# Altium schematic sheet Barun Gas Control.SchDoc
size A3
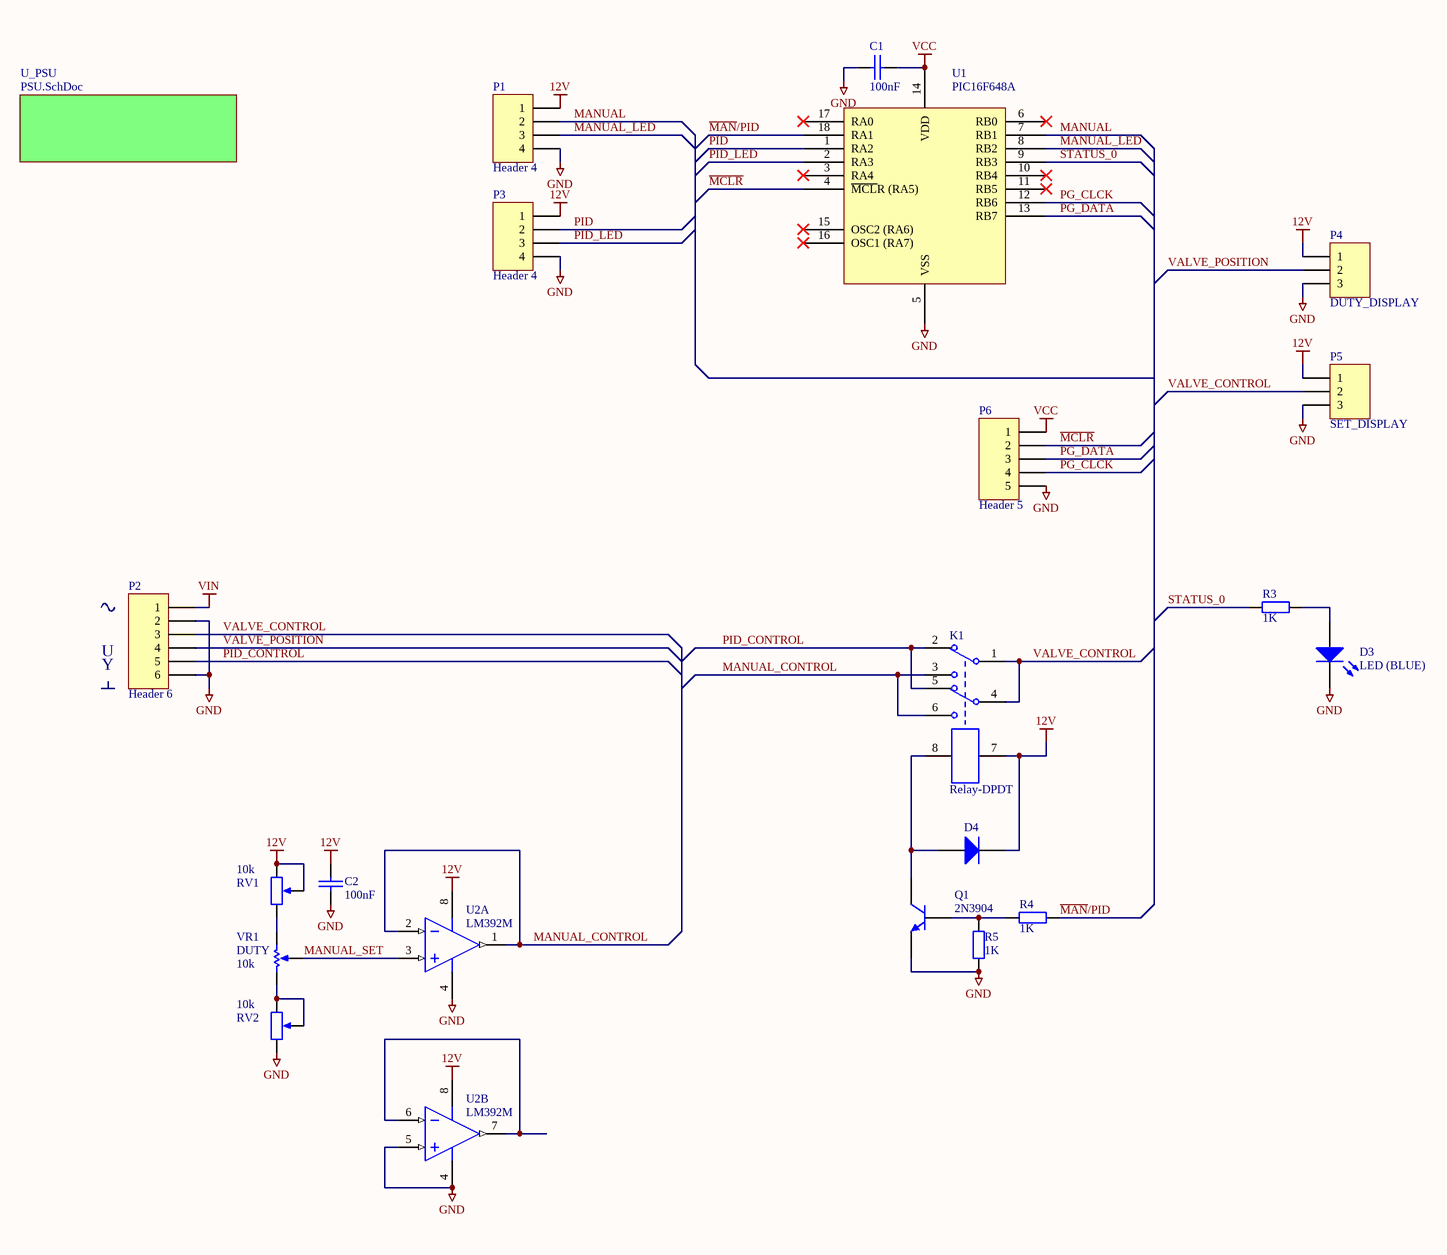
[diagram p0: Barun Gas Control.SchDoc]

## Parts
C1  100nF  [CAP RADIAL 0.200]
C2  100nF  [CAP RADIAL 0.200]
D3  LED (BLUE)  [LED(3D) 5MM VERTICAL (GREEN)]
D4  Diode 1N4148  [DO-35]  (value not drawn)
K1  Relay-DPDT  [RELAY DPDT]
P1  Header 4  [HDR1X4]
P2  Header 6  [6 x 5.08mm]
P3  Header 4  [HDR1X4]
P4  DUTY_DISPLAY  [HDR1X3]
P5  SET_DISPLAY  [HDR1X3]
P6  Header 5  [HDR1X5]
Q1  2N3904  [TO-92A]
R3  value 1K  [AXIAL-0.4]  (hidden comment: Res2)
R4  value 1K  [AXIAL-0.4]  (hidden comment: Res2)
R5  value 1K  [AXIAL-0.4]  (hidden comment: Res2)
RV1  10k  [TRIMMER]
RV2  10k  [TRIMMER]
U1  PIC16F648A  [DIP-18]
U2  LM392M  [DIP_8]  (parts A,B of 2)
VR1  DUTY  value 10k  [HDR1X3]

## Sub-sheets
U_PSU = PSU.SchDoc: no entries

## Nets
12V: C2.2 D4.2(K) K1.7 P1.1 P3.1 P4.1 P5.1 RV1.1 RV1.2 U2.8(V+)
GND: C1.1 C2.1 D3.2(K) P1.4 P2.2 P2.6 P3.4 P4.3 P5.3 P6.5 Q1.1(E) R5.1 RV2.3 U1.5(VSS) U2.4(GND) U2.5(INB+)
VCC: C1.2 P6.1 U1.14(VDD)
VIN: P2.1
~{MCLR}: P6.2 U1.4(~{MCL}R_(RA5))
~{MAN}/PID: R4.1 U1.18(RA1)
MANUAL: P1.2 U1.7(RB1)
MANUAL_CONTROL: K1.3 K1.6 U2.1(OUTA) U2.2(INA-)
MANUAL_LED: P1.3 U1.8(RB2)
MANUAL_SET: U2.3(INA+) VR1.3(TAP)
PG_CLCK: P6.4 U1.12(RB6)
PG_DATA: P6.3 U1.13(RB7)
PID: P3.2 U1.1(RA2)
PID_CONTROL: K1.2 K1.5 P2.5
PID_LED: P3.3 U1.2(RA3)
STATUS_0: R3.2 U1.9(RB3)
VALVE_CONTROL: K1.1 K1.4 P2.3 P5.2
VALVE_POSITION: P2.4 P4.2
NetD3_1: D3.1(A) R3.1
NetD4_1: D4.1(A) K1.8 Q1.3(C)
NetQ1_2: Q1.2(B) R4.2 R5.2
NetRV1_3: RV1.3 VR1.1(TOP)
NetRV2_1: RV2.1 RV2.2 VR1.2(BOT)
NetU2_6: U2.6(INB-) U2.7(OUTB)

Not connected (* = marked no-connect by the designer): U1 3(RA4)* 6(RB0)* 10(RB4)* 11(RB5)* 15(OSC2_(RA6))* 16(OSC1_(RA7))* 17(RA0)*

## Notes on the sheet
- Y
- U

## Library data of the parts
C1 C2 = CAP: CAPACITOR SMD 0402; value: 100nF; Supplier 1: Mouser; Supplier Part Number 1: 810-CGJ3E2X7R1H104K
D3 = LED 3mm RED: 3mm RED LED; Manufacturer: Kingbright; Manufacturer Part No.: WP132XIT; Mouser Part no.: 604-WP132XIT; Farnell Part no.: 1003393; Web link: http://au.mouser.com/Search/Refine.aspx?Keyword=604-WP132XIT
D4 = Diode 1N4148: High Conductance Fast Diode; Published: 8-Jun-2000; LatestRevisionDate: 17-Jul-2002; LatestRevisionNote: Re-released for DXP Platform.; DatasheetVersion: 1997; PackageReference: DO-35; Publisher: Altium Limited; PackageDescription: Diode, Axial; Body 3.8 x 1.9 mm (LxDia. max), Lead Dia. 0.53 mm (max); Code_JEDEC: DO-204-AH; ComponentLink1Description: Manufacturer Link; ComponentLink1URL: http://www.fairchildsemi.com/; ComponentLink2Description: Datasheet; ComponentLink2URL: http://www.fairchildsemi.com/ds/1N%2F1N4148.pdf
K1 = Relay-DPDT: DS2Y-S-DC12V; pin to pad: 1>3 3>1 4>6 6>4; Manufacturer: Generic Components; Revision: July-2002: Re-released for DXP Platform.; Manufacturer: DS2Y-S-DC12V; Manufacturer Part No.: DS2Y-S-DC12V; Web Link: http://www.forward-relays.com/doce/products/product_detail.asp?catalogid=&productid=93
P1 P3 = Header 4: Header, 4-Pin; LatestRevisionDate: 17-Jul-2002; LatestRevisionNote: Re-released for DXP Platform.; Publisher: Altium Limited
P2 = Header 6: Header, 6-Pin; LatestRevisionDate: 17-Jul-2002; LatestRevisionNote: Re-released for DXP Platform.; Publisher: Altium Limited
P4 P5 = Header 3: Header, 3-Pin; LatestRevisionDate: 17-Jul-2002; LatestRevisionNote: Re-released for DXP Platform.; Publisher: Altium Limited
P6 = Header 5: Header, 5-Pin; LatestRevisionDate: 17-Jul-2002; LatestRevisionNote: Re-released for DXP Platform.; Publisher: Altium Limited
Q1 = 2N3904: NPN General Purpose Amplifier; Published: 8-Jun-2000; LatestRevisionDate: 15-Jan-2003; LatestRevisionNote: PCB Footprint 'BCY-W3/D4.7' replaced; DatasheetVersion: 1997; PackageVersion: Sep-1998; PackageReference: TO-92A; Publisher: Altium Limited; PackageDescription: TO, Flat Index; 3 In-Line, Axial Leads; Body Dia. 4.5mm; Leads 0.51 x 0.48 mm (max); ComponentLink1Description: Manufacturer Link; ComponentLink1URL: http://www.fairchildsemi.com/; ComponentLink2Description: Datasheet; ComponentLink2URL: http://www.fairchildsemi.com/ds/2N%2F2N3904.pdf
R3-R5 = Res2: Resistor; Published: 8-Jun-2000; LatestRevisionDate: 17-Jul-2002; LatestRevisionNote: Re-released for DXP Platform.; PackageReference: AXIAL-0.4; Publisher: Altium Limited; PackageDescription: Axial Device, Thru-Hole; 2 Leads; 0.4 in Pin Spacing
RV1 RV2 = VAR (POT) SMD: Variable Resistor; Series: PVZ3A; Value: 10k
U1 = PIC16F87/88: PIC16F88; Manufacturer: Microchip Technology; Manufacturer Part No.: PIC16F88-E/SS; Mouser Part no.: 579-PIC16F88-E/SS; Farnell Part no.: 9761519; value: PIC16F88; Web link: http://au.mouser.com/ProductDetail/Microchip-Technology/PIC16F88-E-SS/?qs=sGAEpiMZZMvu0Nwh4cA1waDrdroEY0RCb%252bRi%252b4Dz0K0%3d
U2 = LM392M: Low Power Operational Amplifier/Voltage Comparator, 8-pin Narrow SOIC; Manufacturer: National Semiconductor; PackageTopMarking: NSZXTT*LM392*M; PowerWise: N; CompType: Amplifiers; Published: 4-Dec-2008; LatestRevisionDate: 13-Jan-2009; LatestRevisionNote: Sim Model Added.; DatasheetVersion: Aug-2000; PackageVersion: revM, May-2009; PackageReference: M08A; Publisher: Altium Limited; PackageDescription: SOIC Narrow, 4.9 x 3.9 x 1.45mm, 8 Lead, 1.27mm Pitch; Supplier 1: Digi-Key; Supplier Part Number 1: LM392M-ND; Supplier 2: Farnell; Supplier Part Number 2: 9486755; PartNumber: LM392M; RoHS: N; PinCount: 8; Code_JEDEC: MS-012-AA; Code_IPC: SOIC127P600-8; ComponentLink1Description: LM392 Datasheet; ComponentLink1URL: http://www.national.com/ds/LM/LM392.pdf; ComponentLink2Description: LM392 Web Page; ComponentLink2URL: http://www.national.com/pf/LM/LM392.html; ComponentLink3Description: M08A Package Page; ComponentLink3URL: http://www.national.com/packaging/folders/m08a.html
VR1 = RPot: Potentiometer; pin to pad: 2>3 3>2; Sim Note: Enter the Resistance value and the set point into parameter fields.; Set Position: 0.5; Published: 8-Jun-2000; LatestRevisionDate: 17-Jul-2002; LatestRevisionNote: Re-released for DXP Platform.; PackageReference: VR5; Publisher: Altium Limited; PackageDescription: Variable Resistor, Thru-Hole; 3 Leads